# EasyEDA Pro project ProPrj_Anniversary_2026-05-06.epro, schematic Schematic1
Board Name: Board1; Create Date: 2026-04-30; Page Name: P1; Project Name: Anniversary; Schematic Name: Schematic1; Update Date: 2026-04-30; Company: EasyEDA.com; Page Size: A4; Version: V1.0
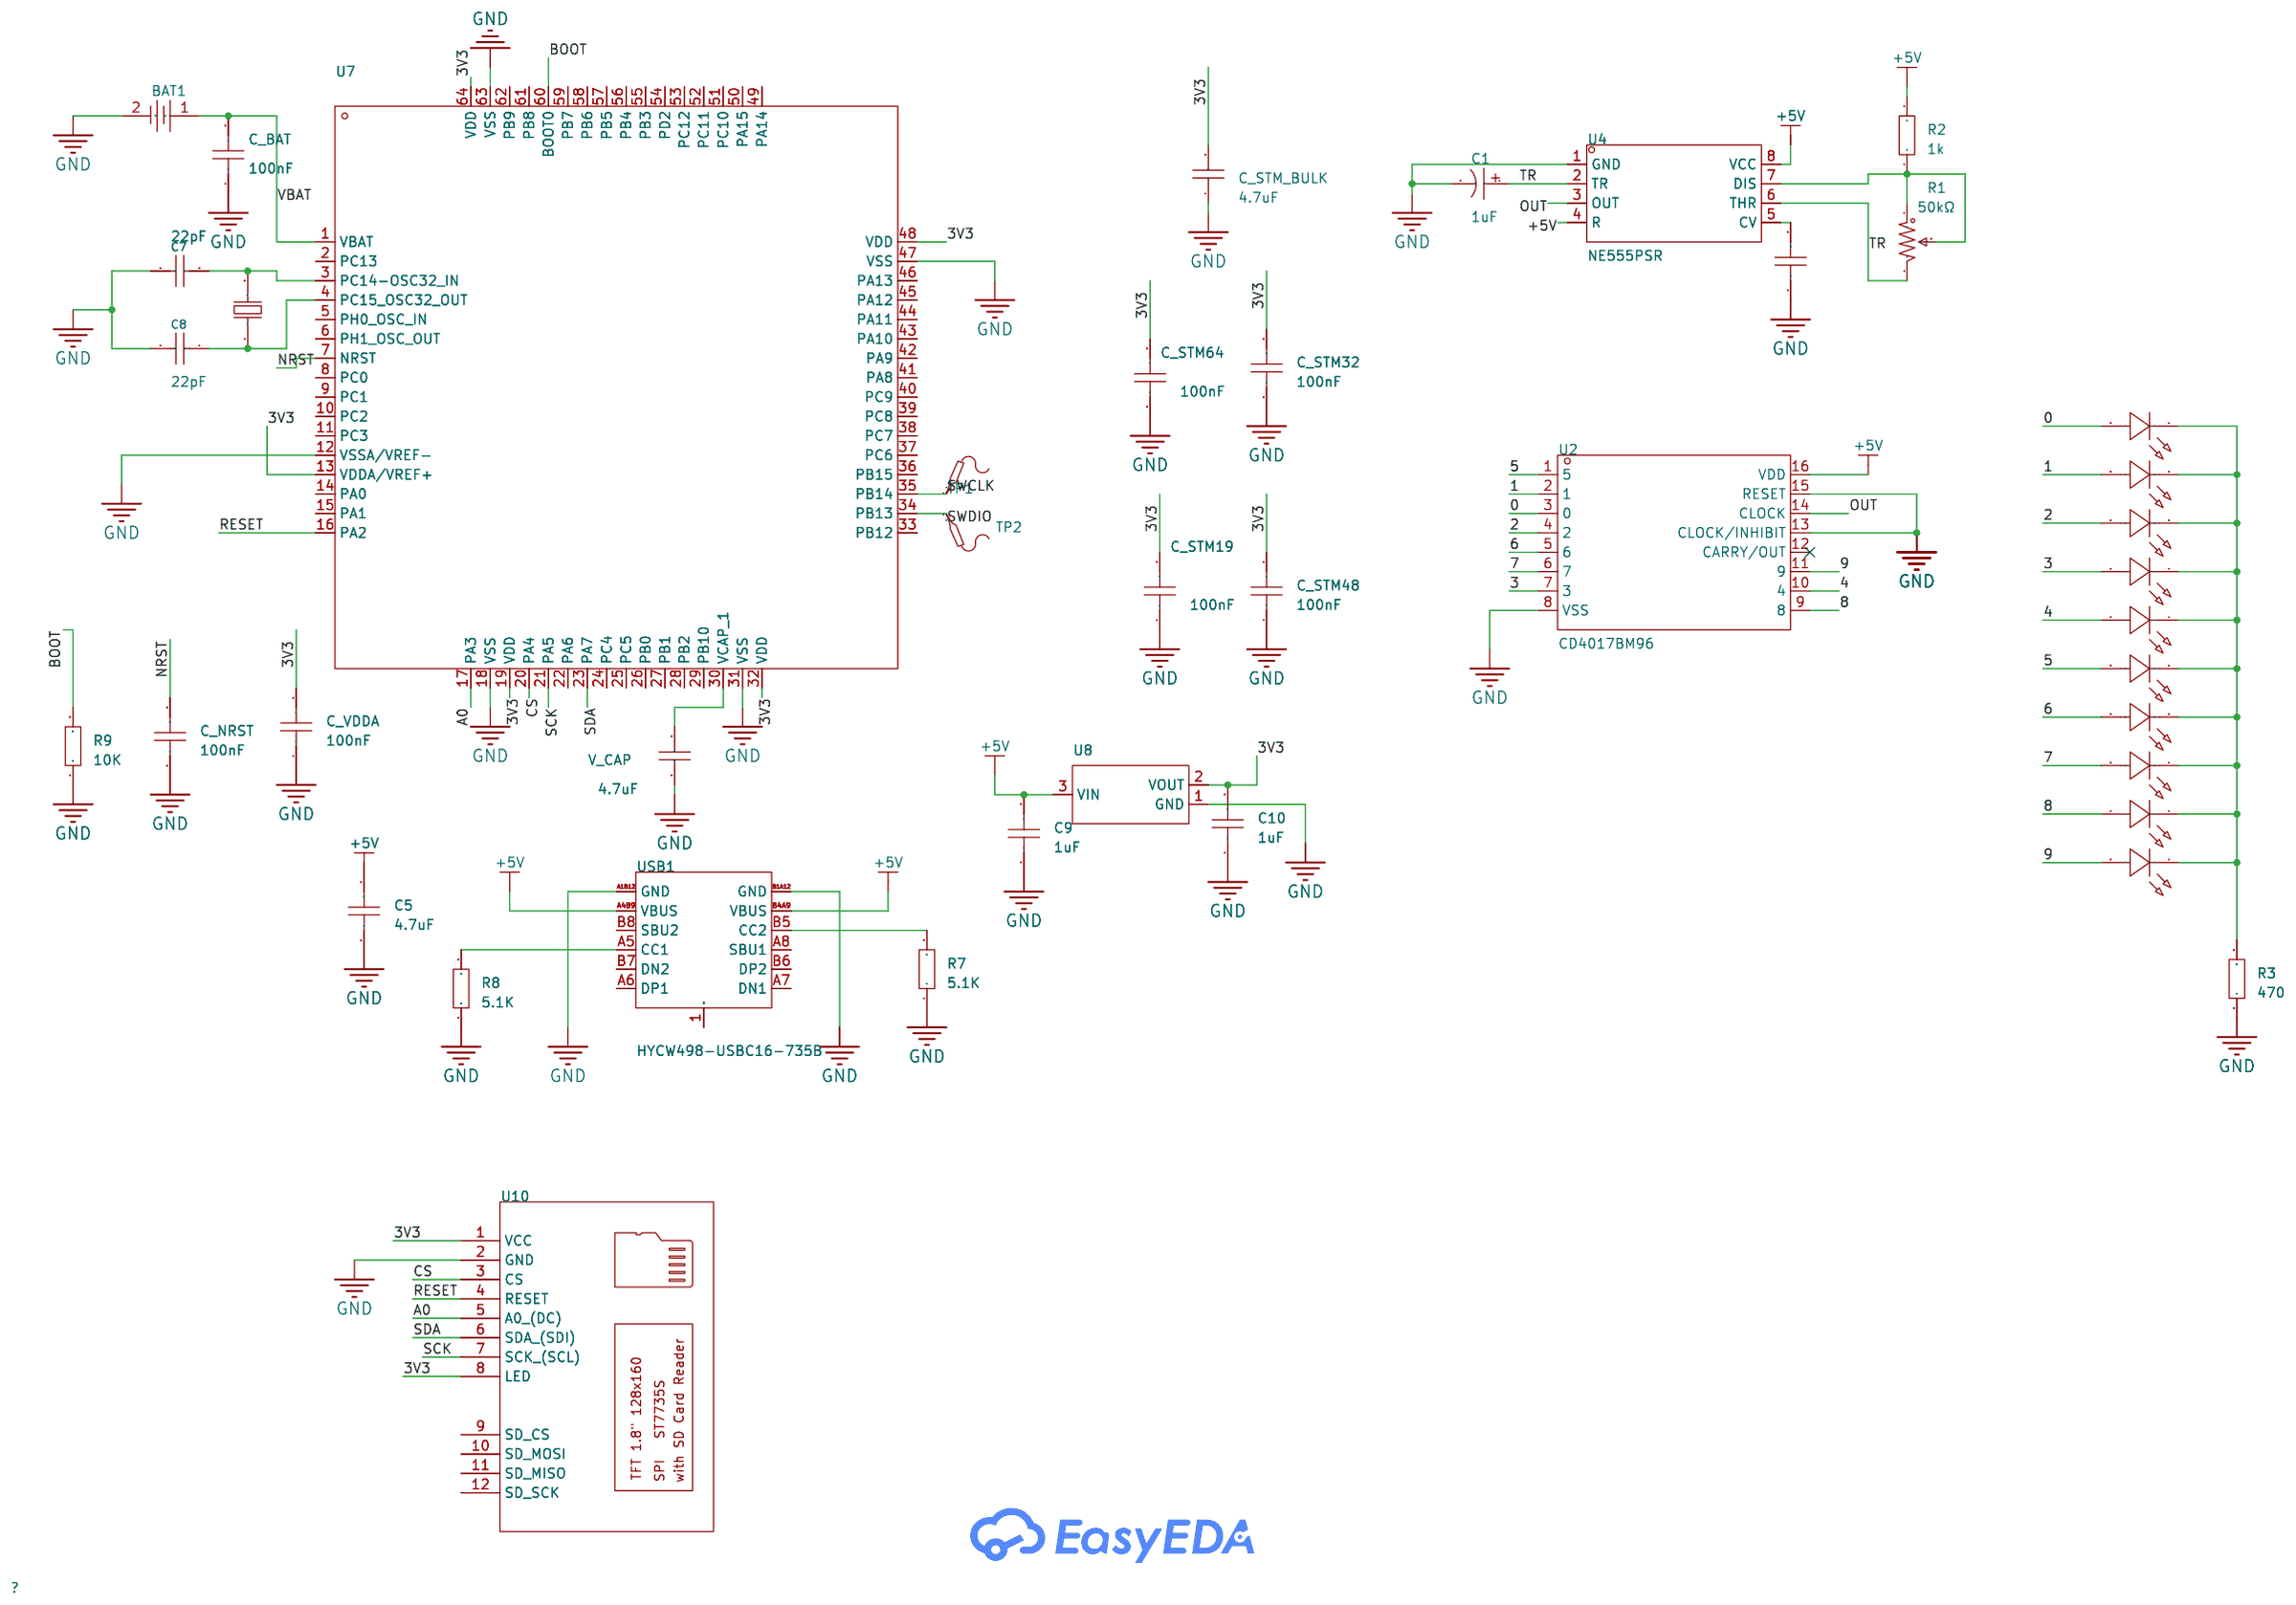
[diagram p1: schematic sheet]

## Parts
BAT1  KH-CR2032-2-1  [BAT-TH_KH-CR2032-2-1]
C1  1uF  [CAP-SMD_BD4.0-L4.3-W4.3-FD]
C2  10nF  [C0805]
C5  4.7uF  [C0805]
C7  22pF  [C0805]
C8  22pF  [C0805]
C9  1uF  [C0805]
C10  1uF  [C0805]
C_BAT  100nF  [C0805]
C_NRST  100nF  [C0805]
C_STM19  100nF  [C0805]
C_STM32  100nF  [C0805]
C_STM48  100nF  [C0805]
C_STM64  100nF  [C0805]
C_STM_BULK  4.7uF  [C0805]
C_VDDA  100nF  [C0805]
LED1  XL-2012SURC  [LED0805-RD_RED]
LED2  XL-2012SURC  [LED0805-RD_RED]
LED3  XL-2012SURC  [LED0805-RD_RED]
LED4  XL-2012SURC  [LED0805-RD_RED]
LED5  XL-2012SURC  [LED0805-RD_RED]
LED6  XL-2012SURC  [LED0805-RD_RED]
LED7  XL-2012SURC  [LED0805-RD_RED]
LED8  XL-2012SURC  [LED0805-RD_RED]
LED9  XL-2012SURC  [LED0805-RD_RED]
LED10  XL-2012SURC  [LED0805-RD_RED]
R1  50kΩ  [RES-ADJ-TH_3P-L9.5-W4.85-P2.50-BL-BS]
R2  1k  [R0603]
R3  470  [R0603]
R7  5.1K  [R0805]
R8  5.1K  [R0805]
R9  10K  [R0603]
TP1  -  [Test-Point-0.5mm]
TP2  -  [Test-Point-0.5mm]
U2  CD4017BM96  [SOIC-16_L9.9-W3.9-P1.27-LS6.0-BL]
U4  NE555PSR  [SOIC-8_L6.2-W5.3-P1.27-LS8.0-BL]
U7  STM32F411RET6  [LQFP-64_L10.0-W10.0-P0.50-LS12.0-BL]
U8  TPMCP1700T-3302E/TT  [SOT-23-3_L2.9-W1.6-P1.90-LS2.8-BR]
U10  -  [1.8 TFT SPI 128x160 ST7735S with CardReader]
USB1  HYCW498-USBC16-735B  [USB-C-SMD_HYCW498-USBC16-735B]
V_CAP  4.7uF  [C0805]
X1  32.768kHz  [FC-135R_L3.2-W1.5]

## Library data of the parts
BAT1 = KH-CR2032-2-1: Connector Type:Battery base Battery Type:CR2032 Contact Material:Brass Contact Plating:Tin Operating Temperature:-55℃~+105℃ Operating Temperature:-55℃~+105℃; LCSC Part Name: 电池底座 适用电池:CR2032; Supplier Part: C5365915; Manufacturer: kinghelm(金航标); Supplier Footprint: 插件; JLCPCB Part Class: Extended Part; Datasheet: https://item.szlcsc.com/datasheet/KH-CR2032-2-1/6198183.html; Supplier: LCSC; Connector Type: Battery base; Battery Type: CR2032; Contact Material: Brass; Contact Plating: Tin; Operating Temperature: -55℃~+105℃
C1 = RVT1H1R0M0405_C72491: Capacitance:1uF Tolerance:±20% Tolerance:±20% Voltage Rating:50V Ripple Current:8mA@120Hz Equivalent Series Resistance(ESR):- Diameter:4mm Height - Seated (Max):5.4mm Lifetime:2000hrs@105℃ Operating Temperature:-40℃~+105℃ Operating Temperature:-40℃~+105℃; LCSC Part Name: 1uF ±20% 50V; Supplier Part: C72491; Manufacturer: ROQANG(容强); Manufacturer Part: RVT1H1R0M0405; Supplier Footprint: SMD,D4xL5.4mm; JLCPCB Part Class: Extended Part; Datasheet: https://item.szlcsc.com/datasheet/RVT1H1R0M0405/73602.html; Supplier: LCSC; Tolerance: ±20%; Voltage Rating: 50V; Ripple Current: 8mA@120Hz; Diameter: 4mm; Height - Seated (Max): 5.4mm; Lifetime: 2000hrs@105℃; Operating Temperature: -40℃~+105℃
C2 = CC0805KRX7R9BB103: Capacitance:10nF Tolerance:±10% Tolerance:±10% Voltage Rating:50V Temperature Coefficient:X7R; LCSC Part Name: 10nF ±10% 50V; Supplier Part: C83170; Manufacturer: YAGEO(国巨); Supplier Footprint: 0805; JLCPCB Part Class: Extended Part; Datasheet: https://item.szlcsc.com/datasheet/CC0805KRX7R9BB103/84334.html; Supplier: LCSC; Tolerance: ±10%; Voltage Rating: 50V; Temperature Coefficient: X7R
C5 = CAP_0603: Supplier Footprint: 0603
C7 C8 = CC0805JRNPO9BN220: Capacitance:22pF Tolerance:±5% Tolerance:±5% Voltage Rating:50V Temperature Coefficient:NP0; LCSC Part Name: 22pF ±5% 50V; Supplier Part: C105623; Manufacturer: YAGEO(国巨); Supplier Footprint: 0805; JLCPCB Part Class: Extended Part; Datasheet: https://item.szlcsc.com/datasheet/CC0805JRNPO9BN220/106838.html; Supplier: LCSC; Tolerance: ±5%; Voltage Rating: 50V; Temperature Coefficient: NP0
C9 C10 = CGA0805X7R105K500MT: Capacitance:1uF Tolerance:±10% Tolerance:±10% Voltage Rating:50V Temperature Coefficient:X7R; LCSC Part Name: 1uF ±10% 50V; Supplier Part: C6119929; Manufacturer: HRE(芯声); Supplier Footprint: 0805; JLCPCB Part Class: Extended Part; Datasheet: https://item.szlcsc.com/datasheet/CGA0805X7R105K500MT/7062635.html; Supplier: LCSC; Tolerance: ±10%; Voltage Rating: 50V; Temperature Coefficient: X7R
C_BAT C_NRST C_STM19 C_STM32 C_STM48 C_STM64 C_VDDA = CC0805KRX7R9BB104: Capacitance:100nF Tolerance:±10% Tolerance:±10% Voltage Rating:50V Temperature Coefficient:X7R; LCSC Part Name: 100nF ±10% 50V; Supplier Part: C49678; Manufacturer: YAGEO(国巨); Supplier Footprint: 0805; JLCPCB Part Class: Basic Part; Datasheet: https://item.szlcsc.com/datasheet/CC0805KRX7R9BB104/50686.html; Supplier: LCSC; Tolerance: ±10%; Voltage Rating: 50V; Temperature Coefficient: X7R
C_STM_BULK V_CAP = CL21A475KAQNNNE: Capacitance:4.7uF Tolerance:±10% Tolerance:±10% Voltage Rating:25V Temperature Coefficient:X5R; LCSC Part Name: 4.7uF ±10% 25V; Supplier Part: C1779; Manufacturer: SAMSUNG(三星); Supplier Footprint: 0805; JLCPCB Part Class: Basic Part; Datasheet: https://item.szlcsc.com/datasheet/CL21A475KAQNNNE/2131.html; Supplier: LCSC; Tolerance: ±10%; Voltage Rating: 25V; Temperature Coefficient: X5R
LED1-LED10 = XL-2012SURC: Lamp Holder Type:- Illumination Color:Red Voltage - Forward(Vf):2.3V Voltage - Forward(Vf):2.3V Power(Watts):- Forward Current:20mA Wavelength - Dominant:615nm~630nm Wavelength - Dominant:615nm~630nm Peak Wavelength:620nm Diode Configuration:Discrete Diod; LCSC Part Name: 0805红贴片式发光二极管; Supplier Part: C965812; Manufacturer: XINGLIGHT(成兴光); Supplier Footprint: 0805; JLCPCB Part Class: Extended Part; Datasheet: https://item.szlcsc.com/datasheet/XL-2012SURC/1051421.html; Supplier: LCSC; Illumination Color: Red; Voltage - Forward(Vf): 2.3V; Forward Current: 20mA; Wavelength - Dominant: 615nm~630nm; Peak Wavelength: 620nm; Diode Configuration: Discrete Diode; Lens Color: Water Clear; Luminous Intensity: 230mcd; Viewing Angle: 120°; Mounting Style: Top-mount; Operating Temperature: -40℃~+85℃
R1 = 3296W-1-503: Resistance:50kΩ Tolerance:±10% Tolerance:±10% Power(Watts):500mW Temperature Coefficient:±250ppm/℃ Temperature Coefficient:±250ppm/℃ Number of Turns:30; LCSC Part Name: 50kΩ ±10%; Supplier Part: C118911; Manufacturer: BOCHEN(博晨); Supplier Footprint: 插件-3P,9.5x4.9mm; JLCPCB Part Class: Extended Part; Datasheet: https://item.szlcsc.com/datasheet/3296W-1-503/120180.html; Supplier: LCSC; Tolerance: ±10%; Power(Watts): 500mW; Temperature Coefficient: ±250ppm/℃; Number of Turns: 30
R2 R3 R7-R9 = Res_0603: Supplier Footprint: 0603
TP1 TP2 = Test-Point: Test Point 测试点
U2 = CD4017BM96: Logic Type:Divide-by-10 Direction:Up Counter Voltage - Supply:3V~18V Voltage - Supply:3V~18V Number of Elements:1 Trigger Type:Rising Edge Reset:Asynchronous Timing:- Count Rate:5.5MHz Operating Temperature:-55℃~+125℃ Operating Temperature:-55℃~+125℃ Prop; LCSC Part Name: CMOS 计数器/分频器，高压类型（20V 额定值）; Supplier Part: C11349; Manufacturer: TI(德州仪器); Supplier Footprint: SOIC-16; JLCPCB Part Class: Extended Part; Datasheet: https://www.ti.com/cn/lit/gpn/cd4017b; Supplier: LCSC; Logic Type: Divide-by-10; Direction: Up Counter; Voltage - Supply: 3V~18V; Number of Elements: 1; Trigger Type: Rising Edge; Reset: Asynchronous; Count Rate: 5.5MHz; Operating Temperature: -55℃~+125℃; Propagation Delay: 135ns
U4 = NE555PSR: Timer Number:1 Voltage - Supply:4.5V~16V Voltage - Supply:4.5V~16V Output Current:200mA Supply Current:2mA Operating Temperature:0℃~+70℃ Operating Temperature:0℃~+70℃ Features:占空比可调振荡；复位功能; LCSC Part Name: 555精密定时器; Supplier Part: C105601; Manufacturer: TI(德州仪器); Supplier Footprint: SOIC-8-208mil; JLCPCB Part Class: Extended Part; Datasheet: https://www.ti.com/cn/lit/gpn/se555; Supplier: LCSC; Timer Number: 1; Voltage - Supply: 4.5V~16V; Output Current: 200mA; Supply Current: 2mA; Operating Temperature: 0℃~+70℃; Features: 占空比可调振荡；复位功能
U7 = STM32F411RET6: CPU Core:ARM-M4 CPU Maximum Speed:100MHz Program Storage Size:512KB Program Memory Type:FLASH Number of I/O:50 ADC (Bit):12bit Voltage - Supply:1.7V~3.6V Voltage - Supply:1.7V~3.6V Applications:-; LCSC Part Name: 带DSP和FPU的高性能基本型系列ARM Cortex-M4 MCU，具有512 KB Flash、100 MHz CPU和ART加速器; Supplier Part: C94355; Manufacturer: ST(意法半导体); Supplier Footprint: LQFP-64(10x10); JLCPCB Part Class: Extended Part; Datasheet: https://item.szlcsc.com/datasheet/STM32F411RET6/95553.html; Supplier: LCSC; CPU Core: ARM-M4; CPU Maximum Speed: 100MHz; Program Storage Size: 512KB; Program Memory Type: FLASH; Number of I/O: 50; ADC (Bit): 12bit; Voltage - Supply: 1.7V~3.6V
U8 = TPMCP1700T-3302E/TT: Output Type:Fixed Voltage - Supply:6.5V Output Voltage:3.3V Output Voltage:3.3V Output Current:450mA Power Supply Rejection Ratio (PSRR):40dB@(1kHz) Voltage Dropout:170mV@(250mA) standby current:1.6uA Features:Over Current Protection；Over Temperature Prot; LCSC Part Name: 3.3V 450mA 6.5V; Supplier Part: C3021127; Manufacturer: TECH PUBLIC(台舟); Supplier Footprint: SOT-23L; JLCPCB Part Class: Extended Part; Datasheet: https://item.szlcsc.com/datasheet/TPMCP1700T-3302E%252FTT/3544109.html; Supplier: LCSC; Output Type: Fixed; Voltage - Supply: 6.5V; Output Voltage: 3.3V; Output Current: 450mA; Power Supply Rejection Ratio (PSRR): 40dB@(1kHz); Voltage Dropout: 170mV@(250mA); standby current: 1.6uA; Features: Over Current Protection；Over Temperature Protection; Operating Temperature: -40℃~+125℃@(Tj); Output Configuration: Positive; Number of Outputs: 1
U10 = 1.8 TFT SPI 128x160 ST7735S with CardReader
USB1 = HYCW498-USBC16-735B: Connector Type:Type-C Protocol Standard:USB 3.1 Gender:Female Mounting Type:Surface Mount, Right Angle Number of Contacts:16P Number of Ports:1 Current Rating-Power:3A Voltage Rating:- Connect-Disconnect Life:10,000 cycles Length:7.35mm Detection color:Bl; LCSC Part Name: Type-C 母 卧贴; Supplier Part: C42400252; Manufacturer: HOAUC(华宇创); Supplier Footprint: SMD; JLCPCB Part Class: Extended Part; Datasheet: https://item.szlcsc.com/datasheet/HYCW498-USBC16-735B/44352785.html; Supplier: LCSC; Connector Type: Type-C; Protocol Standard: USB 3.1; Gender: Female; Mounting Type: Surface Mount, Right Angle; Number of Contacts: 16P; Number of Ports: 1; Current Rating-Power: 3A; Connect-Disconnect Life: 10,000 cycles; Length: 7.35mm; Detection color: Black; Operating Temperature: -30℃~+85℃
X1 = Q13FC13500004_C32346: Type:Crystal Oscillator Frequency:32.768kHz Normal temperature Frequency Tolerance:±20ppm Normal temperature Frequency Tolerance:±20ppm Load Capacitance:12.5pF Equivalent Series Resistance(ESR):70kΩ Operating Temperature:-40℃~+85℃ Operating Temperature:-4; LCSC Part Name: 32.768kHz ±20ppm 12.5pF; Supplier Part: C32346; Manufacturer: EPSON(爱普生); Manufacturer Part: Q13FC13500004; Supplier Footprint: SMD3215-2P; JLCPCB Part Class: Basic Part; Datasheet: https://item.szlcsc.com/datasheet/Q13FC13500004/33310.html; Supplier: LCSC; Type: Crystal Oscillator; Normal temperature Frequency Tolerance: ±20ppm; Load Capacitance: 12.5pF; Equivalent Series Resistance(ESR): 70kΩ; Operating Temperature: -40℃~+85℃

## Nets
3V3: C10.2 C_STM19.2 C_STM32.2 C_STM48.2 C_STM64.2 C_STM_BULK.2 C_VDDA.2 U7.13(VDDA/VREF+) U7.19(VDD) U7.32(VDD) U7.48(VDD) U7.64(VDD) U8.2(VOUT) U10.1(VCC) U10.8(LED)
+5V: C5.1 C9.2 R2.2 U2.16(VDD) U4.4(R) U4.8(VCC) U8.3(VIN) USB1.A4B9(VBUS) USB1.B4A9(VBUS)
GND: BAT1.2 C1.2 C2.1 C5.2 C7.1 C8.1 C9.1 C10.1 C_BAT.1 C_NRST.1 C_STM19.1 C_STM32.1 C_STM48.1 C_STM64.1 C_STM_BULK.1 C_VDDA.1 R3.1 R7.1 R8.1 R9.1 U2.8(VSS) U2.13(CLOCK/INHIBIT) U2.15(RESET) U4.1(GND) U7.12(VSSA/VREF-) U7.18(VSS) U7.31(VSS) U7.47(VSS) U7.63(VSS) U8.1(GND) U10.2(GND) USB1.A1B12(GND) USB1.B1A12(GND) V_CAP.1
VBAT: BAT1.1 C_BAT.2 U7.1(VBAT)
0: LED1.2(A) U2.3(0)
1: LED2.2(A) U2.2(1)
2: LED3.2(A) U2.4(2)
3: LED4.2(A) U2.7(3)
4: LED5.2(A) U2.10(4)
5: LED6.2(A) U2.1(5)
6: LED7.2(A) U2.5(6)
7: LED8.2(A) U2.6(7)
8: LED9.2(A) U2.9(8)
9: LED10.2(A) U2.11(9)
A0: U7.17(PA3) U10.5(A0 (DC))
BOOT: R9.2 U7.60(BOOT0)
CS: U7.20(PA4) U10.3(CS)
NRST: C_NRST.2 U7.7(NRST)
OUT: U2.14(CLOCK) U4.3(OUT)
RESET: U7.16(PA2) U10.4(RESET)
SCK: U7.21(PA5) U10.7(SCK (SCL))
SDA: U7.23(PA7) U10.6(SDA (SDI))
SWCLK: TP1.1 U7.35(PB14)
SWDIO: TP2.1 U7.34(PB13)
TR: C1.1 R1.3 U4.2(TR) U4.6(THR)
$1N2239: C2.2 U4.5(CV)
$1N2271: R1.1 R1.2 R2.1 U4.7(DIS)
$1N3321: LED1.1(K) LED2.1(K) LED3.1(K) LED4.1(K) LED5.1(K) LED6.1(K) LED7.1(K) LED8.1(K) LED9.1(K) LED10.1(K) R3.2
$1N4944: R7.2 USB1.B5(CC2)
$1N4947: R8.2 USB1.A5(CC1)
$1N5442: C7.2 U7.3(PC14-OSC32_IN) X1.2
$1N5448: C8.2 U7.4(PC15_OSC32_OUT) X1.1
$1N6586: U7.30(VCAP_1) V_CAP.2

Not connected (* = marked no-connect by the designer): U2 12(CARRY/OUT)*; U7 2(PC13) 5(PH0_OSC_IN) 6(PH1_OSC_OUT) 8(PC0) 9(PC1) 10(PC2) 11(PC3) 14(PA0) 15(PA1) 22(PA6) 24(PC4) 25(PC5) 26(PB0) 27(PB1) 28(PB2) 29(PB10) 33(PB12) 36(PB15) 37(PC6) 38(PC7) 39(PC8) 40(PC9) 41(PA8) 42(PA9) 43(PA10) 44(PA11) 45(PA12) 46(PA13) 49(PA14) 50(PA15) 51(PC10) 52(PC11) 53(PC12) 54(PD2) 55(PB3) 56(PB4) 57(PB5) 58(PB6) 59(PB7) 61(PB8) 62(PB9); U10 9(SD_CS) 10(SD_MOSI) 11(SD_MISO) 12(SD_SCK); USB1 1(SHELL) A6(DP1) A7(DN1) A8(SBU1) B6(DP2) B7(DN2) B8(SBU2)
